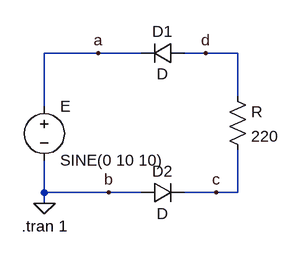
[diagram p0: schematic Draft8.asc]
Draft8.asc, the LTspice schematic file:
Version 4
SHEET 1 880 680
WIRE 160 64 80 64
WIRE 224 64 160 64
WIRE 320 64 288 64
WIRE 368 64 320 64
WIRE 368 128 368 64
WIRE 80 144 80 64
WIRE 80 272 80 224
WIRE 176 272 80 272
WIRE 224 272 176 272
WIRE 336 272 288 272
WIRE 368 272 368 208
WIRE 368 272 336 272
WIRE 80 288 80 272
FLAG 80 288 0
FLAG 160 64 a
FLAG 320 64 d
FLAG 336 272 c
FLAG 176 272 b
SYMBOL voltage 80 128 R0
WINDOW 123 0 0 Left 0
WINDOW 39 0 0 Left 0
SYMATTR InstName E
SYMATTR Value SINE(0 10 10)
SYMBOL diode 288 48 R90
WINDOW 0 0 32 VBottom 2
WINDOW 3 32 32 VTop 2
SYMATTR InstName D1
SYMBOL diode 224 288 R270
WINDOW 0 32 32 VTop 2
WINDOW 3 0 32 VBottom 2
SYMATTR InstName D2
SYMBOL res 352 112 R0
SYMATTR InstName R
SYMATTR Value 220
SYMATTR SpiceLine tol=1 pwr=0.1
TEXT 46 322 Left 2 !.tran 1

The netlist it stands for:
* Draft8.asc
V§E a 0 SINE(0 10 10)
D1 d a D
D2 0 c D
R d c 220 tol=1 pwr=0.1
.model D D
.lib standard.dio
.tran 1
.backanno
.end

* Results of the author's LTspice run, read from the files saved beside the schematic
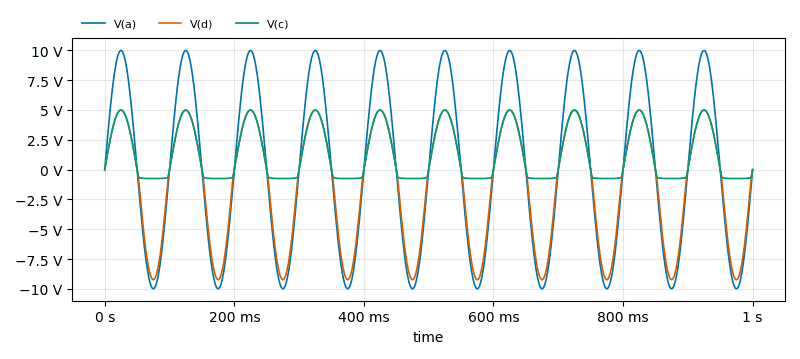
[diagram p1: Transient Analysis of Draft8.asc, plotted from the saved traces]
* Transient Analysis, 1 run:
*   V(a): min -9.995 V, max 9.999 V, average -126.6 µV, rms 7.07 V, last 0 V
*   V(d): min -9.236 V, max 4.995 V, average -1.241 V, rms 5.171 V, last 0 V
*   V(c): min -749.6 mV, max 4.995 V, average 1.241 V, rms 2.547 V, last 0 V